# Altium schematic sheet BaiDoXe_RFID.SchDoc
size A
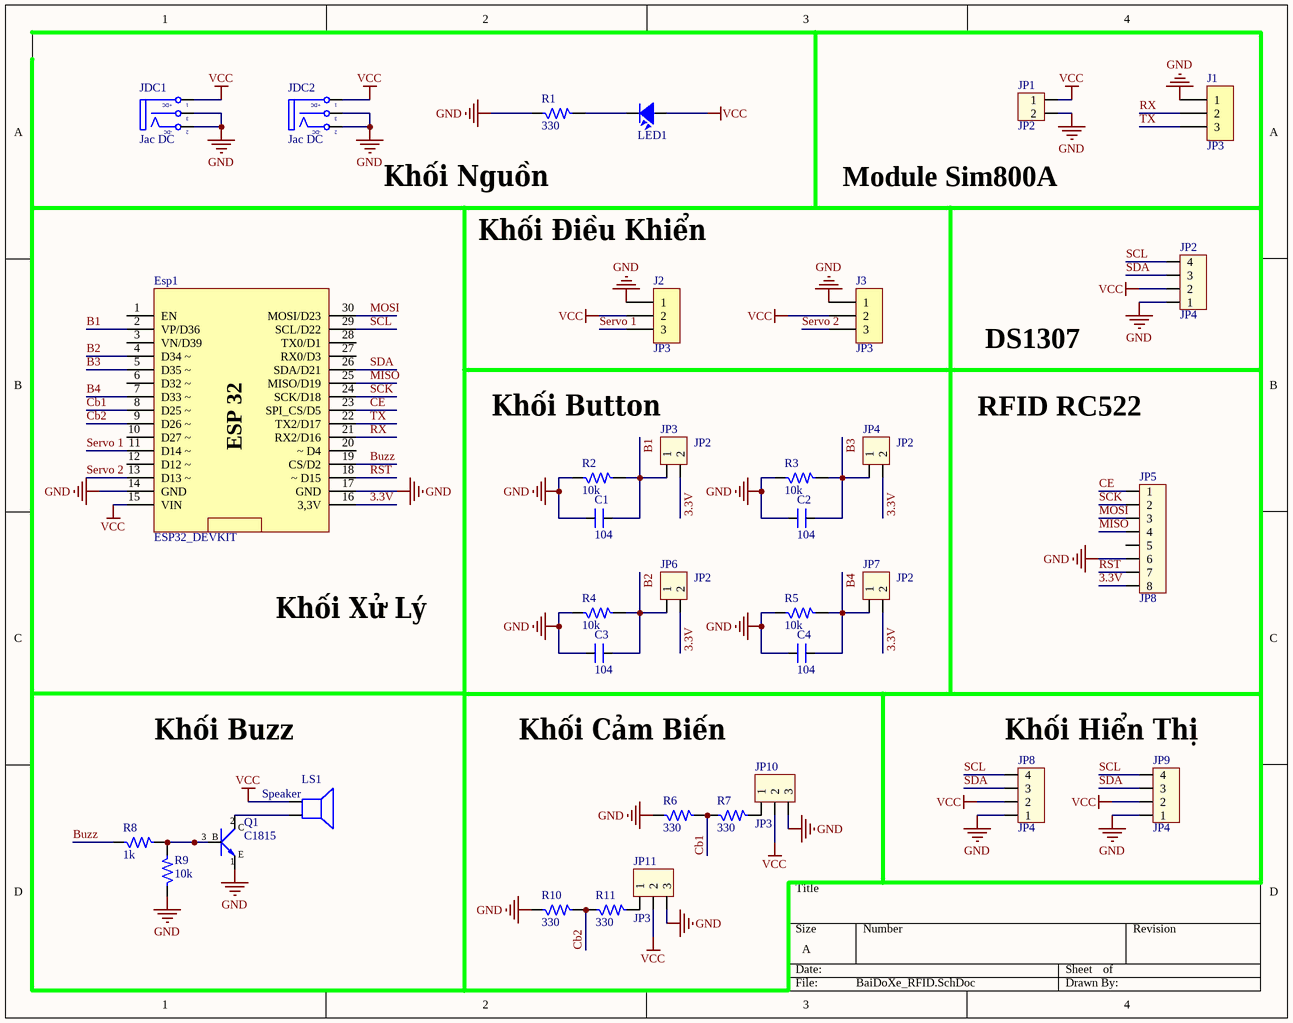
[diagram p0: BaiDoXe_RFID.SchDoc]

## Parts
C1  104  [SM-CAP-0805]
C2  104  [SM-CAP-0805]
C3  104  [SM-CAP-0805]
C4  104  [SM-CAP-0805]
Esp1  ESP32_DEVKIT  [Esp32_Devkit]
J1  JP3  [JUMP DON 3]
J2  JP3  [JUMP DON 3]
J3  JP3  [JUMP DON 3]
JDC1  Jac DC  [DC-IN]
JDC2  Jac DC  [DC-IN]
JP1  JP2  [CON2]
JP2  JP4  [CON4]
JP3  JP2  [CON2]
JP4  JP2  [CON2]
JP5  JP8  [CON8]
JP6  JP2  [CON2]
JP7  JP2  [CON2]
JP8  JP4  [CON4]
JP9  JP4  [CON4]
JP10  JP3  [CON3]
JP11  JP3  [CON3]
LED1  LED  [LED-5-BLUE]  (value not drawn)
LS1  Speaker  [SPEAKER]
Q1  C1815  [SOT23B]
R1  330  [res_0805]
R2  10k  [res_0805]
R3  10k  [res_0805]
R4  10k  [res_0805]
R5  10k  [res_0805]
R6  330  [res_0805]
R7  330  [res_0805]
R8  1k  [res_0805]
R9  10k  [res_0805]
R10  330  [res_0805]
R11  330  [res_0805]

## Nets
GND: C1.1 C2.1 C3.1 C4.1 Esp1.14(GND) Esp1.17(GND) J1.1 J2.1 J3.1 JDC1.2(TN) JDC1.3(S) JDC2.2(TN) JDC2.3(S) JP1.2 JP2.1 JP5.6 JP8.1 JP9.1 JP10.3 JP11.3 Q1.1(E) R1.1 R2.1 R3.1 R4.1 R5.1 R6.1 R9.1 R10.1
VCC: Esp1.15(VIN) J2.2 J3.2 JDC1.1(T) JDC2.1(T) JP1.1 JP2.2 JP8.2 JP9.2 JP10.2 JP11.2 LED1.1 LS1.1
3.3V: Esp1.16(3,3V) JP3.2 JP4.2 JP5.8 JP6.2 JP7.2
B1: C1.2 Esp1.2(VP/D36) JP3.1 R2.2
B2: C3.2 Esp1.4(D34_~) JP6.1 R4.2
B3: C2.2 Esp1.5(D35_~) JP4.1 R3.2
B4: C4.2 Esp1.7(D33_~) JP7.1 R5.2
Buzz: Esp1.19(CS/D2) R8.1
Cb1: Esp1.8(D25_~) R6.2 R7.1
Cb2: Esp1.9(D26_~) R10.2 R11.1
CE: Esp1.23(SPI_CS/D5) JP5.1
MISO: Esp1.25(MISO/D19) JP5.4
MOSI: Esp1.30(MOSI/D23) JP5.3
RST: Esp1.18(~_D15) JP5.7
RX: Esp1.21(RX2/D16) J1.2
SCK: Esp1.24(SCK/D18) JP5.2
SCL: Esp1.29(SCL/D22) JP2.4 JP8.4 JP9.4
SDA: Esp1.26(SDA/D21) JP2.3 JP8.3 JP9.3
Servo 1: Esp1.11(D14_~) J2.3
Servo 2: Esp1.13(D13_~) J3.3
TX: Esp1.22(TX2/D17) J1.3
NetJP10_1: JP10.1 R7.2
NetJP11_1: JP11.1 R11.2
NetLED1_2: LED1.2 R1.2
NetLS1_2: LS1.2 Q1.2(C)
NetQ1_3: Q1.3(B) R8.2 R9.2

Not connected (* = marked no-connect by the designer): Esp1 1(EN) 3(VN/D39) 6(D32_~) 10(D27_~) 12(D12_~) 20(~_D4) 27(RX0/D3) 28(TX0/D1); JP5 5

## Notes on the sheet
- Khối Nguồn
- (near JP1) Module Sim800A
- Khối Điều Khiển
- DS1307
- Khối Button
- RFID RC522
- Khối Xử Lý
- Khối Buzz
- Khối Cảm Biến
- Khối Hiển Thị
- (in symbol DCIN) +DC; -DC
- (in symbol ESP32_DEVKIT) ESP 32

## Library data of the parts
C1-C4 = CN: Value: 0,1uF/300V; Designed by: VanDungEvn
J1-J3 = JUMP 3: JUMP DON DUC 2.54
JDC1 JDC2 = DCIN: Jac DC input; Value: Jac DC
JP1 JP3 JP4 JP6 JP7 = Con2: Connector 2; Value: Connector 2
JP2 JP8 JP9 = Con4: Connector 4; Value: Connector 4
JP5 = Con8: Connector 8; Value: Connector 8
JP10 JP11 = Con3: Connector 3; Value: Connector 3
LED1 = LED: LED Single colour Green and Red; Value: LED 3 ly Single Colour
LS1 = Speaker: Loudspeaker; Published: 24-Mar-1999; LatestRevisionDate: 17-Jul-2002; LatestRevisionNote: Re-released for DXP Platform.; PackageReference: PIN2; Publisher: Altium Limited
Q1 = C1815: C1815 Dan (SMD); Value: C9014
R1-R11 = RES 0805: TRO DAN 0805; Value: R1/4W - 1K